# EAGLE design 200 watts standard cool dip (EAGLE 7.6.0)
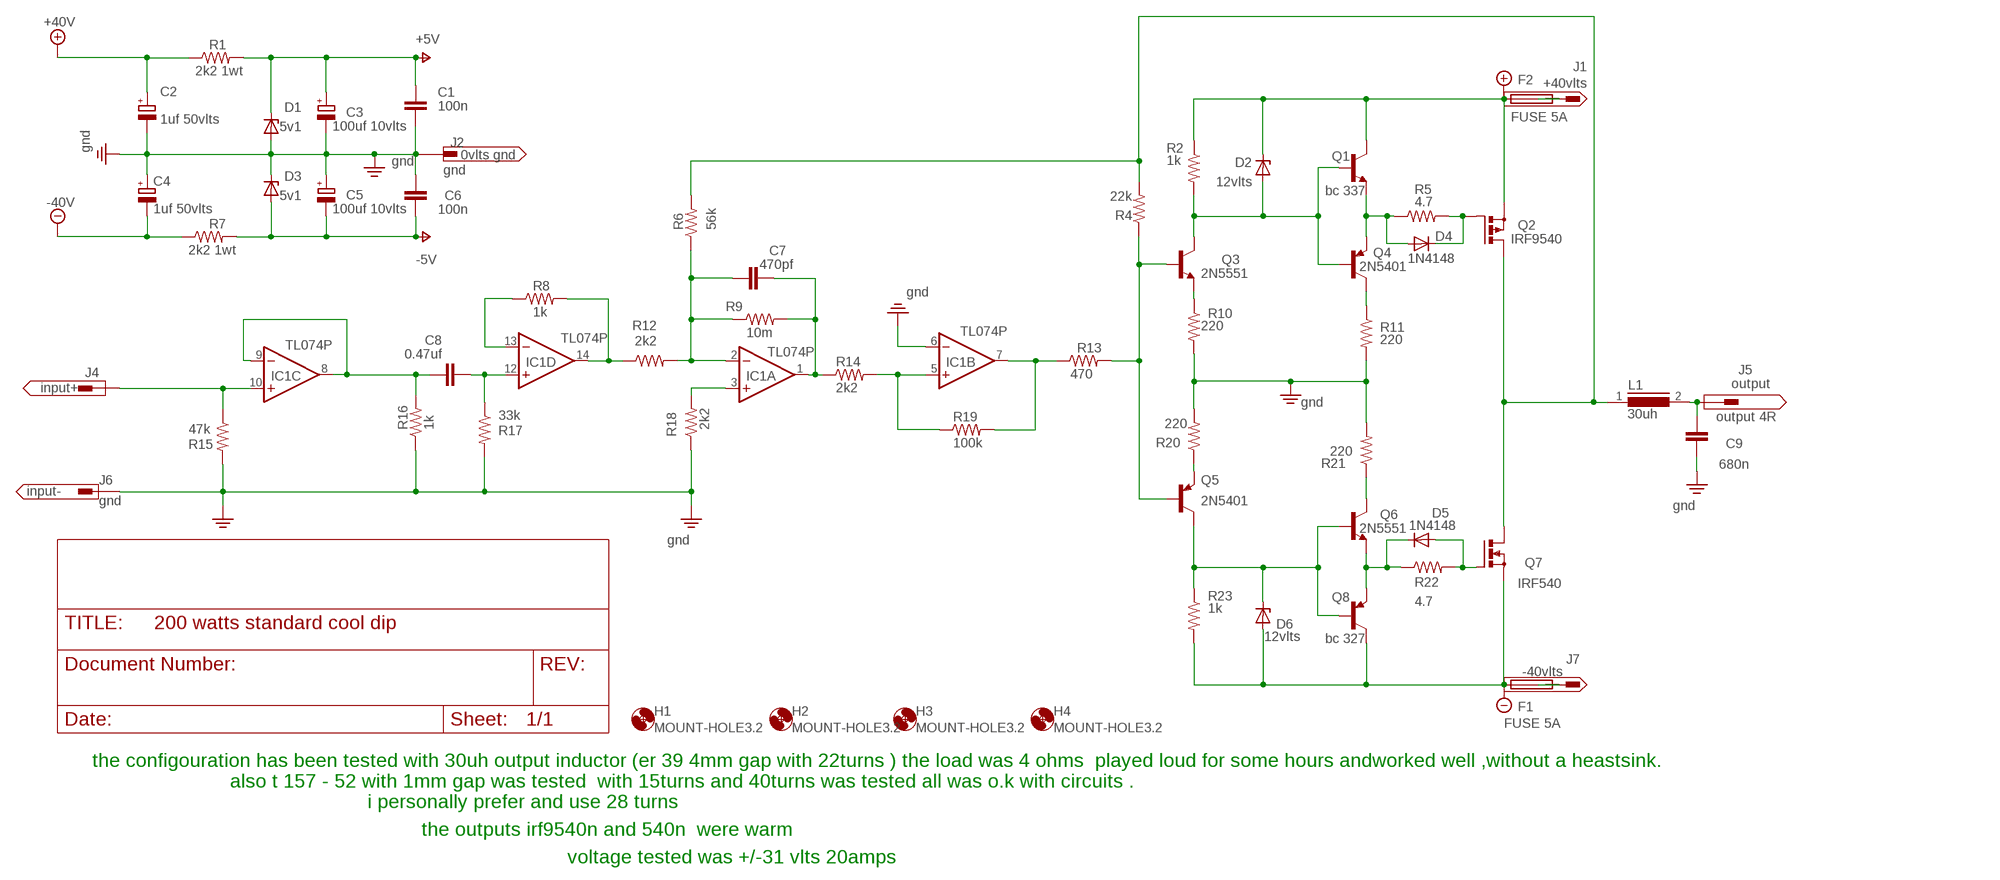
[diagram p0: schematic, sheet 1]

## Parts
C1  100n  C7.5/5  [C7.5B5]
C2  1uf 50vlts  CPOL-EUE2.5-6  [E2,5-6]
C3  100uf 10vlts  CPOL-EUE3.5-8  [E3,5-8]
C4  1uf 50vlts  CPOL-EUE2.5-6  [E2,5-6]
C5  100uf 10vlts  CPOL-EUE3.5-8  [E3,5-8]
C6  100n  C7.5/5  [C7.5B5]
C7  470pf  C5/3.5  [C5B3.5]
C8  0.47uf  C7.5/6  [C7.5B6]
C9  680n  C15/6  [C15B6]
D1  5v1  ZENER-DIODEDO34-7  [DO34Z7]
D2  12vlts  ZENER-DIODEDO34-7  [DO34Z7]
D3  5v1  ZENER-DIODEDO34-7  [DO34Z7]
D4  1N4148  1N4148DO35-7  [DO35-7]
D5  1N4148  1N4148DO35-7  [DO35-7]
D6  12vlts  ZENER-DIODEDO34-7  [DO34Z7]
F1  FUSE 5A  FUSESHK20L  [SHK20L]
F2  FUSE 5A  FUSESHK20L  [SHK20L]
H1  MOUNT-HOLE3.2  [3,2]
H2  MOUNT-HOLE3.2  [3,2]
H3  MOUNT-HOLE3.2  [3,2]
H4  MOUNT-HOLE3.2  [3,2]
IC1  TL074P  [DIL14]
J1  +40v  PIN2F061.040  [F061.040]
J2  gnd  PIN2F061.040  [F061.040]
J4  input  PIN2F061.040  [F061.040]
J5  output  PIN2F061.040  [F061.040]
J6  gnd  PIN2F061.040  [F061.040]
J7  -40v  PIN2F061.040  [F061.040]
L1  30uh  B82131  [SUKW1-17]
Q1  bc 337  BF393-NPN-TO92-CBE  [TO92-CBE]
Q2  IRF9540  PMOSFET_PTO220BV  [TO220BV]
Q3  2N5551  BC338-16-NPN-TO92-EBC  [TO92-EBC]
Q4  2N5401  BC327-25-PNP-TO92-EBC  [TO92-EBC]
Q5  2N5401  BC327-25-PNP-TO92-EBC  [TO92-EBC]
Q6  2N5551  BC338-16-NPN-TO92-EBC  [TO92-EBC]
Q7  IRF540  PMOSFET_NTO220BV  [TO220BV]
Q8  bc 327  BF493S-PNP-TO92-CBE  [TO92-CBE]
R1  2k2 1wt  R-US_0309/12  [0309/12]
R2  1k  R-US_0207/7  [0207/7]
R4  22k  R-US_0207/7  [0207/7]
R5  4.7  R-US_0207/7  [0207/7]
R6  56k  R-US_0207/7  [0207/7]
R7  2k2 1wt  R-US_0309/12  [0309/12]
R8  1k  R-US_0207/2V  [0207/2V]
R9  10m  R-US_0207/2V  [0207/2V]
R10  220  R-US_0207/7  [0207/7]
R11  220  R-US_0207/7  [0207/7]
R12  2k2  R-US_0207/7  [0207/7]
R13  470  R-US_0207/7  [0207/7]
R14  2k2  R-US_0207/10  [0207/10]
R15  47k  R-US_0207/2V  [0207/2V]
R16  1k  R-US_0207/7  [0207/7]
R17  33k  R-US_0207/2V  [0207/2V]
R18  2k2  R-US_0207/7  [0207/7]
R19  100k  R-US_0207/5V  [0207/5V]
R20  220  R-US_0207/7  [0207/7]
R21  220  R-US_0207/7  [0207/7]
R22  4.7  R-US_0207/7  [0207/7]
R23  1k  R-US_0207/7  [0207/7]

## Nets
+5V: C1.1 C3.+ D1.C R1.2
+40V: C2.+ D2.C F2.1A Q1.C Q2.S R1.1 R2.1
-5V: C5.- C6.2 D3.A R7.2
-40V: C4.- D6.A F1.1A Q7.S Q8.C R7.1 R23.2 ; supply symbol labelled -40v
GND: C1.2 C2.- C3.- C4.+ C5.+ C6.1 C9.1 D1.A D3.C IC1.6(B:-IN) J2.A1 J2.A2 J6.A1 J6.A2 R10.2 R11.2 R15.2 R16.1 R17.2 R18.1 R20.2 R21.2 ; supply symbol labelled gnd
N$1: D5.A Q7.G R22.2
N$2: D4.A Q1.E Q4.E R5.1
N$3: D4.C Q2.G R5.2
N$4: C9.2 J5.A1 J5.A2 L1.2
N$5: L1.1 Q2.D Q7.D R4.2 R6.2
N$6: D6.C Q5.C Q6.B Q8.B R23.1
N$7: Q6.C R21.1
N$8: D5.C Q6.E Q8.E R22.1
N$9: Q4.C R11.1
N$10: Q5.E R20.1
N$11: F1.2A J7.A1 J7.A2
N$12: Q3.E R10.1
N$13: D2.A Q1.B Q3.C Q4.B R2.2
N$15: F2.2A J1.A1 J1.A2
N$16: Q3.B Q5.B R4.1 R13.2
N$20: IC1.7(B:OUT) R13.1 R19.2
N$41: IC1.5(B:+IN) R14.2 R19.1
N$49: C7.1 IC1.2(A:-IN) R6.1 R9.1 R12.2
N$54: IC1.3(A:+IN) R18.2
N$55: IC1.14(D:OUT) R8.2 R12.1
N$56: IC1.13(D:-IN) R8.1
N$57: C8.1 IC1.8(C:OUT) IC1.9(C:-IN) R16.2
N$60: C7.2 IC1.1(A:OUT) R9.2 R14.1
N$61: C8.2 IC1.12(D:+IN) R17.1
N$62: IC1.10(C:+IN) J4.A1 J4.A2 R15.1

## Notes on the sheet
- the configouration has been tested with 30uh output inductor (er 39 4mm gap with 22turns ) the load was 4 ohms  played loud for some hours andworked well ,without a heastsink.
- also t 157 - 52 with 1mm gap was tested  with 15turns and 40turns was tested all was o.k with circuits .
                           i personally prefer and use 28 turns
- the outputs irf9540n and 540n  were warm
- voltage tested was +/-31 vlts 20amps

## Power pins joined to a net without a drawn wire
+5V: IC1.4(P:V+)
-5V: IC1.11(P:V-)

## Library data of the parts
C1 C6-C9 = capacitor-wima:C: CAPACITOR naming: grid - package width
C2-C5 = rcl:CPOL-EU: POLARIZED CAPACITOR, European symbol
D1-D3 D6 = diode:ZENER-DIODE: Z-Diode
D4 D5 = diode:1N4148: DIODE high speed (Philips)
F1 F2 = fuse:FUSE: Fuse
H1-H4 = holes:MOUNT-HOLE: MOUNTING HOLE with drill center marker
IC1 = linear:TL074: OP AMP
J1 J2 J4-J7 = con-faston:PIN2: Flachstecker Typ Tyco/Electronics/AMP TAB, FASTON Printed Circuit Board Tabs Source: http://www.buerklin.com, http://catalog.tycoelectronics.com; OC_FARNELL: unknown; OC_NEWARK: unknown
L1 = inductors:B82131: INDUCTOR
Q1 Q3 Q6 = transistor:*-NPN-: NPN Transistror BF959 corrected 2008.03.06
Q2 = transistor-power (2):PMOSFET_P: Power MOSFET P-Channel
Q4 Q5 Q8 = transistor:*-PNP-: PNP Transistror
Q7 = transistor-power (2):PMOSFET_N: Power MOSFET N-Channel
R1 R2 R4-R23 = rcl:R-US_: RESISTOR, American symbol

## Board
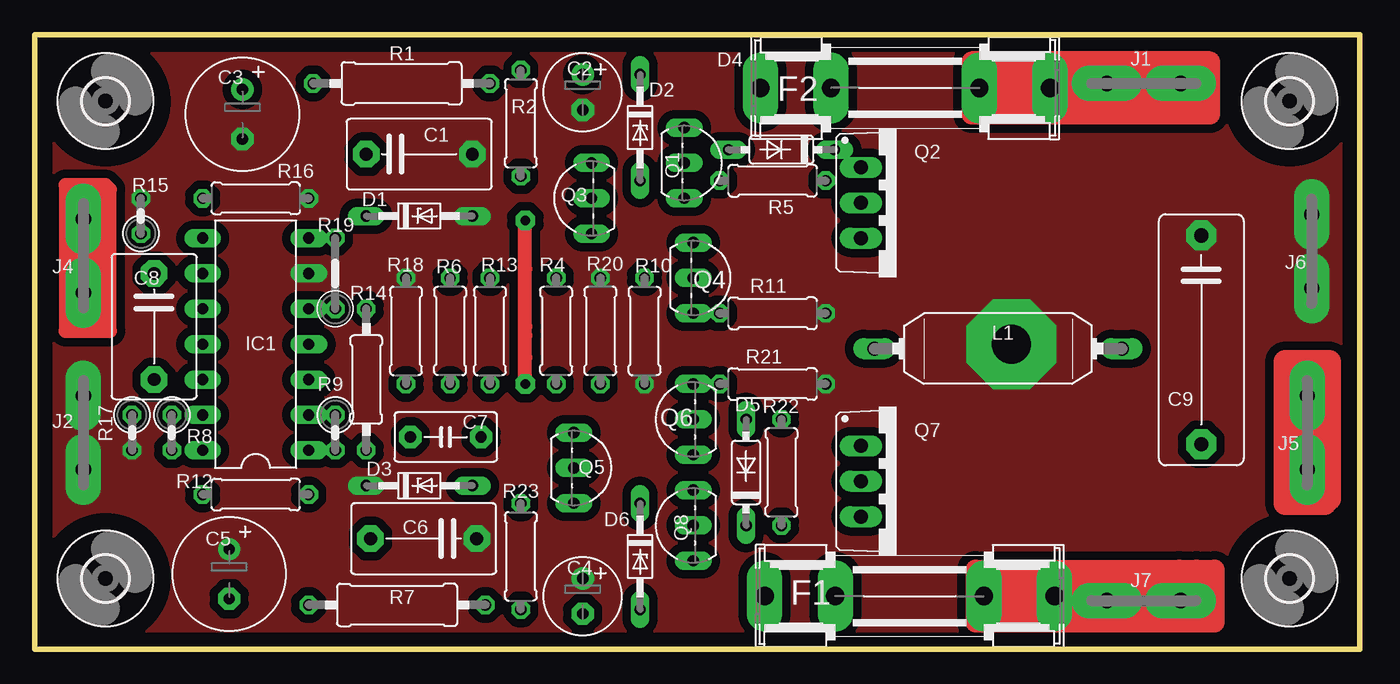
[diagram p1: board, top side]
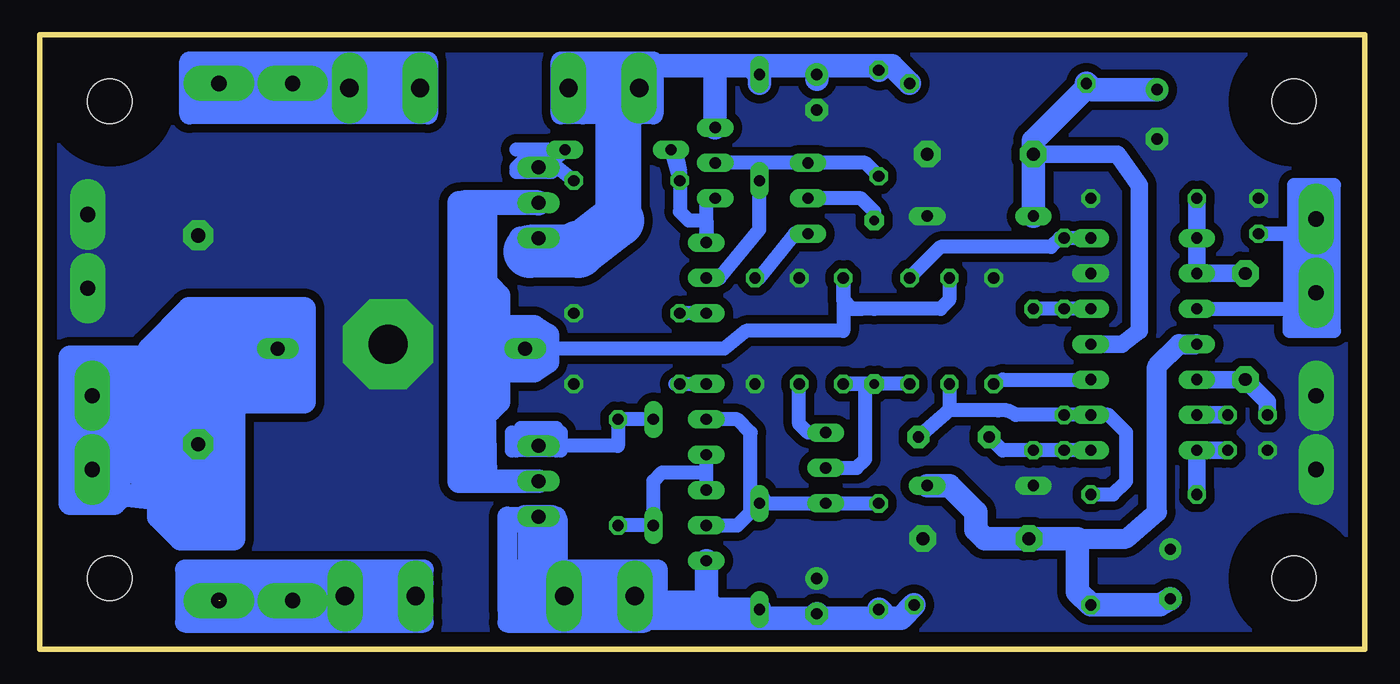
[diagram p2: board, bottom side, seen from below]

Size 95.23 x 44.12 mm. Coordinates in mm from the lower left corner, seen from the top.
Outline: 0,0 95.23,0 95.23,44.12 0,44.12 0,0
Copper layers (1*16): Top 0.035mm / dielectric 1.5mm / Bottom 0.035mm
Design rules "default": minimum track width 10mil, minimum drill 24mil, track to track 8mil, track to pad 8mil, pad to pad 8mil, via to via 8mil, smd to smd 8mil, copper to edge 40mil, drill to drill 8mil, minimum pad ring 10mil, minimum via ring 8mil, stop-mask expansion 4mil, vias tented up to drill 0mil, thermal gap 10mil

### Footprints (pad centres in the part's own frame; a part is rotated, then mirrored left to right if it is on the bottom)
C7.5B5 = drill 0.914 pad 1.905 octagon: 1 -3.81,0; 2 3.81,0
E2,5-6 = drill 0.813 pad 1.6: + -1.27,0 | drill 0.813 pad 1.6 octagon: - 1.27,0
E3,5-8 = drill 0.813 pad 1.6: + -1.778,0 | drill 0.813 pad 1.6 octagon: - 1.778,0
C5B3.5 = drill 0.813 pad 1.6 octagon: 1 -2.54,0; 2 2.54,0
C7.5B6 = drill 0.914 pad 1.905 octagon: 1 -3.81,0; 2 3.81,0
C15B6 = drill 1.016 pad 2.159 octagon: 1 -7.493,0; 2 7.493,0
DO34Z7 = drill 0.813 long: A 3.81,0; C -3.81,0
DO35-7 = drill 0.813 long: A 3.81,0; C -3.81,0
SHK20L = drill 1.321 pad 2.54 long: 1A -10.414,0; 1B -5.334,0; 2A 10.414,0; 2B 5.334,0
3,2 = hole 3.2: 0,0
DIL14 = drill 0.813 long: 1 -7.62,-3.81; 2 -5.08,-3.81; 3 -2.54,-3.81; 4 0,-3.81; 5 2.54,-3.81; 6 5.08,-3.81; 7 7.62,-3.81; 8 7.62,3.81; 9 5.08,3.81; 10 2.54,3.81; 11 0,3.81; 12 -2.54,3.81; 13 -5.08,3.81; 14 -7.62,3.81
F061.040 = drill 1.1 pad 2.54 long: A1 -2.65,0; A2 2.65,0
SUKW1-17 = drill 1.016 long: 1 -8.89,0; 2 8.89,0
TO92-CBE = drill 0.813 long: B 0,0; C -2.54,0; E 2.54,0
TO220BV = drill 1.016 long: D 0,-2.54; G -2.54,-2.54; S 2.54,-2.54
TO92-EBC = drill 0.813 long: B 0,-1.27; C 2.54,-1.27; E -2.54,-1.27
0309/12 = drill 0.813 octagon: 1 -6.35,0; 2 6.35,0
0207/7 = drill 0.813 octagon: 1 -3.81,0; 2 3.81,0
0207/2V = drill 0.813 octagon: 1 -1.27,0; 2 1.27,0
0207/10 = drill 0.813 octagon: 1 -5.08,0; 2 5.08,0
0207/5V = drill 0.813 octagon: 1 -2.54,0; 2 2.54,0

### Placement (x,y rotation side)
C1  27.62,35.56 0 top
C2  39.37,40.01 270 top
C3  14.92,38.42 270 top
C4  39.37,3.81 270 top
C5  13.97,5.4 270 top
C6  27.94,7.94 180 top
C7  29.53,15.24 180 top
C8  8.57,23.18 270 top
C9  83.82,22.23 270 top
D1  27.62,31.11 0 top
D2  43.5,37.47 270 top
D3  27.62,11.75 0 top
D4  53.66,35.88 180 top
D5  51.12,12.7 90 top
D6  43.5,6.67 270 top
F1  62.87,3.81 0 top
F2  62.55,40.32 0 top
H1  5.08,5.08 0 top
H2  5.08,39.37 0 top
H3  90.17,5.08 0 top
H4  90.17,39.37 0 top
IC1  15.88,21.91 90 top
J1  79.69,40.64 0 top
J2  3.49,15.56 270 top
J4  3.49,28.26 270 top
J5  91.44,15.56 270 top
J6  91.76,28.57 270 top
J7  79.69,3.49 0 top
L1  69.22,21.59 0 top
Q1  46.67,34.92 270 top
Q2  61.91,32.07 270 top
Q3  38.73,32.38 90 top
Q4  48.58,26.67 270 top
Q5  40.01,13.02 270 top
Q6  46.04,16.51 90 top
Q7  61.91,12.06 270 top
Q8  47.31,8.89 90 top
R1  26.35,40.64 180 top
R2  34.92,37.78 270 top
R4  37.47,22.86 90 top
R5  53.02,33.66 0 top
R6  29.84,22.86 90 top
R7  26.04,3.17 180 top
R8  9.84,15.56 270 top
R9  21.59,15.56 270 top
R10  43.81,22.86 270 top
R11  53.02,24.13 0 top
R12  15.88,11.11 0 top
R13  32.7,22.86 270 top
R14  23.81,19.37 90 top
R15  7.62,31.11 90 top
R16  15.88,32.38 180 top
R17  6.99,15.56 270 top
R18  26.67,22.86 270 top
R19  21.59,26.99 90 top
R20  40.64,22.86 90 top
R21  53.02,19.05 0 top
R22  53.66,12.7 90 top
R23  34.92,6.67 270 top

### Tracks (layer width: path | path; a pad name or v marks a point on that pad's centre or on a via)
+5V
  Bottom 1.27: IC1.4 17.46,21.91 16.19,22.86 16.19,33.34 17.78,35.56 C1.1
  Bottom 1.676: C3.+ 19.56,40.2 R1.2 20,40.32 23.81,36.51 C1.1 D1.C
+40V
  Bottom 1.016: Q2.S 60.64,29.53 60.64,29.21 60.96,28.89 60.96,28.57 60.96,28.26
  Bottom 1.422: F2.1A 51.75,40.32 51.75,38.73 52.07,38.73 52.07,38.42 56.2,38.42 | 56.2,38.42 57.78,38.42 57.78,41.91 57.78,42.23 51.12,42.23 51.12,38.42 56.2,38.42 | 56.2,38.42 56.2,39.69 55.56,39.69 55.56,39.37 53.34,39.37 53.34,40.96 54.17,40.96 54.17,40.58
  Bottom 1.676: 56.2,41.91 56.52,41.91 56.83,39.69 | 56.2,40.64 56.2,41.91 | 56.2,41.91 46.67,41.91 | 46.67,41.91 44.13,41.91 | 44.13,41.91 D2.C | D2.C 43.5,41.59 | 43.5,41.59 43.18,41.91 43.81,41.91 | 43.81,41.91 44.13,41.91 | 44.13,41.91 43.81,41.91 | 43.81,41.91 39.05,41.91 | 39.05,41.91 34.92,41.91 | 34.92,41.91 33.97,41.91 R1.1 | R2.1 34.92,41.91 | C2.+ 39.37,40.96 39.37,41.59 39.05,41.91 | D2.C 43.5,40.64 43.5,41.59 | 43.5,41.59 43.81,41.91 | 43.81,41.91 46.67,41.91 | 46.67,41.91 Q1.C | 60.96,28.57 60.96,28.26 60.96,28.57 | 60.96,28.57 60.96,28.89 | 60.96,28.89 60.64,29.21 | 60.64,29.21 60.64,29.53 | 60.64,29.53 Q2.S | Q2.S 60.64,29.53 | 60.64,29.53 60.64,29.21 | 60.64,29.21 60.96,28.89 | 60.96,28.89 60.96,28.57 | 60.01,28.57 60.01,28.89 Q2.S
  Bottom 1.778: 56.83,39.69 56.52,41.91 57.15,40.32 54.93,40.96
  Bottom 2.54: 54.93,40.96 54.17,40.58 53.66,40.32
  Bottom 3.302: 53.66,40.32 53.66,30.8
  Bottom 3.81: 53.66,30.8 56.52,28.57 | 56.52,28.57 56.52,28.89 56.52,28.57 | 56.52,28.57 60.01,28.57
-5V
  Bottom 1.422: C6.2 22.86,7.94 20.64,7.94 17.14,7.94 14.92,9.84 14.92,20.32 13.34,21.91 IC1.11
  Bottom 1.676: D3.A 29.84,11.75 27.94,9.84 27.94,8.57 27.3,7.94 C6.2 22.86,7.94 20.64,7.94 20.64,4.13 R7.2 14.73,3.17 C5.-
-40V
  Bottom 1.422: 47.31,3.49 50.8,3.49 50.8,5.71 61.28,5.71 61.59,5.4 | 61.59,5.4 61.59,1.91 | 61.59,1.91 60.96,2.54 61.59,1.91 | 61.59,1.91 51.75,1.91 51.75,3.17 | 51.75,3.17 51.75,4.45 58.1,4.45 58.1,4.13 | 58.1,4.13 58.1,3.17 51.75,3.17 | 51.75,3.17 61.59,3.49 61.59,2.86 61.59,5.4 | 61.59,5.4 61.59,9.53 58.1,9.53 58.1,4.13 | 58.1,4.13 53.34,4.13 52.45,4.13 F1.1A
  Bottom 1.676: 60.01,2.22 59.05,2.22 | 59.05,2.22 59.05,3.17 | 59.05,3.17 58.42,2.22 44.13,2.22 D6.A | D6.A 43.5,2.54 43.81,2.22 39.69,2.22 C4.- 39.37,2.22 33.34,2.22 | 33.34,2.22 R7.1 | 33.34,2.22 34.29,2.22 R23.2 | D6.A 46.67,2.86 47.31,3.49 Q8.C | 59.05,2.22 58.1,3.17 58.1,4.13 58.1,4.45 58.1,9.21 58.42,9.53 59.05,9.53 | 59.05,9.53 Q7.S | Q7.S 60.01,9.53 | 60.01,9.53 60.33,9.53 60.96,9.21 | 59.05,3.17 59.05,2.54 59.69,3.17 | 59.69,3.17 60.01,2.22 | 60.01,2.22 60.01,5.4 | 60.01,2.86 59.69,3.17 | 59.69,3.17 59.05,3.81 59.05,9.53 | 59.05,9.53 Q7.S | Q7.S 60.01,9.53 | 60.01,9.53 60.01,2.22 | 60.01,2.22 60.01,3.81 60.64,4.45 | 60.01,2.22 59.69,3.17
GND  (via drill 2.8 pad 6.45)
  other vias: 70.17,21.91
  pour Bottom (isolate 0.61, no thermals): 1.27,1.27 93.98,1.27 93.98,43.18 1.27,43.18
  pour Top (isolate 0.61, no thermals): 1.27,1.27 93.98,1.27 93.98,43.18 1.27,43.18
N$1
  Bottom 1.016: D5.A R22.2 53.66,14.61 57.78,14.61 | 57.78,14.61 Q7.G 59.05,14.61 58.1,14.29 | 58.1,14.29 61.28,14.29 61.28,15.56 | 60.96,14.29 60.96,15.24 60.64,14.92 58.42,14.92 57.78,15.56 | 57.78,15.56 57.78,14.61 | 57.78,14.61 57.78,14.29 58.1,14.29 | 58.1,14.29 57.78,14.61 | 57.78,14.61 57.78,15.56 | 57.78,15.56 58.1,15.88 60.64,15.88
N$2
  Bottom 1.016: R5.1 D4.A 49.53,35.88 49.21,34.29 49.21,33.34 49.21,31.43 48.58,30.8 47.31,30.8 | 47.31,30.8 Q4.E 47.31,30.48 47.31,30.8 | 47.31,30.8 47.31,31.43 47.31,32.38 Q1.E
N$3
  Bottom 1.016: D4.C 58.42,34.92 | 58.42,34.92 R5.2 58.42,34.92 | 58.42,34.92 Q2.G 59.69,34.61 59.69,34.92 59.05,35.56 60.01,35.56 60.96,34.61 60.96,34.29 58.42,34.29 58.42,35.56 58.74,35.88 60.96,35.88
N$4  (via drill 0.7 pad 1.42)
  Top 1.676: J5.A2 91.44,12.7 93.03,11.11 93.03,20.64 89.85,20.64 89.85,10.48 90.81,10.48 | 90.81,10.48 92.71,10.48 | 92.71,10.48 93.03,10.79 93.03,18.1 91.44,19.68 v91.44,13.02 | v91.44,13.02 91.44,11.75 92.71,10.48 | 92.71,10.48 90.81,10.48 | 90.81,10.48 90.81,19.37 90.49,19.68 90.49,13.97 v91.44,13.02
  Bottom 1.016: 81.28,17.78 81.92,18.1 83.19,16.83 83.19,11.43 84.14,10.48 84.14,20.64 83.82,20.95 83.5,21.27 78.74,21.27 L1.2
  Bottom 1.676: v91.44,13.02 91.44,12.7 91.44,12.38 93.03,10.79 93.03,12.06 | 93.03,12.06 93.03,20.64 91.76,20.64 | 91.76,20.64 91.12,20.64 | 91.12,20.64 89.85,20.64 89.85,10.48 93.03,10.48 93.03,12.06 | 93.03,12.06 92.08,11.11 92.08,20.32 91.76,20.64 | 91.76,20.64 91.44,20.64 91.12,20.32 91.12,11.11 91.44,10.79 90.49,10.79 90.49,20 91.12,20.64 | 91.12,20.64 91.76,20.64 | 91.76,20.64 91.76,13.02 | 91.76,13.02 91.76,12.38 | 91.76,12.38 91.76,10.79 91.76,12.38 | 91.76,12.38 89.53,11.11 | 89.53,11.11 86.68,10.79 86.68,10.16 86.68,9.53 85.09,7.94 81.28,7.94 81.28,17.78 76.52,17.78 76.2,17.78 76.2,24.45 76.83,21.27 76.52,24.45 84.45,24.45 87.31,21.59 87.31,20.95 87.31,20.64 87.63,20.32 87.63,20.64 87.95,20.95 93.03,20.95 93.03,14.29 91.76,13.02 | 91.76,13.02 89.53,10.79 89.53,11.11 | 89.53,11.11 89.53,18.73 89.22,19.05 89.22,19.37 86.68,19.37 86.04,20 86.04,20.95 83.5,23.5
  Bottom 2.54: 83.5,23.5 77.79,23.5 76.83,22.23 76.83,21.27 77.47,20.95
  Bottom 3.81: 77.47,20.95 83.82,20.95 85.09,19.68 87.63,17.14 87.63,13.97 87.95,13.65 87.31,13.65 84.14,10.48 83.82,10.16 82.55,10.16 82.55,19.05 78.42,19.05 77.79,19.68 83.5,19.68 86.04,17.14 86.04,15.88 85.09,14.92 85.09,12.19 C9.2 83.82,12.38 85.72,14.29 90.49,14.29 91.76,13.02 | J5.A1 91.44,18.41 81.6,18.41 L1.2
N$5
  Bottom 1.016: R6.2 29.84,25.08 30.48,24.45 35.24,24.45 36.2,24.45 | 36.2,24.45 36.83,24.45 | 36.83,24.45 37.47,25.08 | 37.47,25.08 R4.2 37.47,26.35 37.47,25.08 | 37.47,25.08 36.83,24.45 | 36.83,24.45 36.2,24.45 | 36.2,24.45 36.83,24.45 | 36.83,24.45 37.47,25.08 | 37.47,25.08 37.47,22.86 44.45,22.86 46.04,21.59 L1.1 | L1.1 60.64,21.59 L1.1
  Bottom 1.676: Q7.D 63.5,12.06 | 63.5,12.06 64.14,12.06 | 64.14,12.06 65.09,12.06 | 65.09,12.06 64.14,12.06 | 64.14,12.06 63.5,12.06 | 63.5,12.06 Q7.D | Q7.D 63.5,12.06 | 63.5,12.06 63.18,12.38 63.5,26.67 | 63.5,26.67 63.18,26.04 | 63.18,26.04 63.5,32.07 Q2.D | 63.18,26.04 63.18,31.75 64.14,32.07 64.45,32.07 | 64.45,32.07 65.09,32.07 65.09,12.7 65.09,12.06 | 65.09,12.06 64.14,12.06 | 64.14,12.06 64.45,21.59 | 64.45,21.59 64.45,32.07 | 64.45,32.07 64.45,21.59 | 64.45,21.59 64.45,22.86 64.14,23.18 59.69,23.18 58.74,22.54 58.74,20.64 59.69,20 62.23,20 | 62.23,20 62.87,19.68 63.18,20 63.18,21.59 62.55,20.95 60.33,20.95 60.01,20.64 60.01,21.91 59.69,22.23 62.55,22.23 62.55,24.13 | 62.55,24.13 62.55,25.72 63.5,26.67 | 63.5,26.67 63.5,17.14 63.18,16.83 62.87,17.14 | 62.87,17.14 62.23,17.78 | 62.23,17.78 62.23,20 | 62.23,20 61.59,20.64 61.59,21.91 62.23,22.54 62.23,25.4 63.18,25.4 63.18,20.64 62.23,20 | 62.23,20 62.23,17.78 | 62.23,17.78 62.87,17.14 | 62.87,17.14 62.87,23.81 62.55,24.13 | 62.55,24.13 62.55,22.86 61.28,21.59 L1.1
  Bottom 1.778: Q2.D 63.5,32.07 64.14,32.07 64.45,32.07 64.77,32.07
N$6
  Bottom 1.016: D6.C 44.13,9.84 | 44.13,9.84 43.81,10.79 | 43.81,10.79 43.5,11.11 | 43.5,11.11 43.18,10.79 44.13,9.84 | 44.13,9.84 43.81,10.79 | 43.81,10.79 44.13,9.84 | 44.13,9.84 43.5,11.11 | 43.5,11.11 44.13,9.84 | 44.13,9.84 44.13,15.56 45.09,16.51 Q6.B | Q8.B 45.09,8.89 44.13,9.84 | 44.13,9.84 D6.C | D6.C Q5.C R23.1
N$7
  Bottom 1.016: R21.1 49.53,19.05 Q6.C
N$8
  Bottom 1.016: Q8.E 47.31,12.7 | 47.31,12.7 Q6.E | 47.31,12.7 50.48,12.7 51.12,12.06 D5.C R22.1
N$9
  Bottom 1.016: Q4.C R11.1
N$10
  Bottom 1.016: Q5.E 40.01,15.56 40.64,16.19 40.64,18.73 R20.1
N$11  (via drill 0.6)  (1 unrouted)
  Top 1.422: v82.23,3.49 82.23,5.71 84.77,5.71 84.77,1.91 67.63,1.91 67.63,5.71 83.5,5.71 83.5,5.08 83.5,4.45 | 83.5,4.45 83.5,2.86 68.26,2.86 68.26,4.45 83.5,4.45 | 83.5,4.45 83.82,4.45 83.82,3.81 F1.2A | F1.2A 68.9,3.81 68.9,4.13 73.28,4.13 F1.2A
  Bottom 1.422: J7.A1 68.58,3.49 | 68.58,3.49 67.63,3.49 67.63,4.76 | 67.63,4.76 67.63,5.71 84.77,5.71 84.77,1.91 67.63,1.91 67.63,4.76 | 67.63,4.76 83.82,4.76 83.82,2.54 68.58,2.54 68.58,3.49 | 68.58,3.49 v82.23,3.49 | v82.23,3.49 83.5,3.49 82.23,2.86 v82.23,3.49
N$12
  Bottom 1.016: R10.1 43.5,26.67 40.96,29.84 Q3.E
N$13
  Bottom 1.016: R2.2 35.88,34.92 Q3.C 43.5,34.92 | 43.5,34.92 43.5,34.29 D2.A | D2.A 43.5,34.92 | 43.5,34.92 46.35,34.92 Q1.B | Q4.B 46.67,26.67 46.35,26.67 43.5,30.16 43.5,32.07 D2.A
N$15
  Top 1.422: J1.A1 76.83,40.64 76.83,42.23 67.31,42.23 67.31,38.42 84.45,38.42 84.45,42.23 68.26,42.23 68.26,40.96 83.82,40.96 83.82,40.64 83.82,39.37 67.94,39.37 67.94,39.69 82.34,39.69 J1.A2
  Bottom 1.422: F2.2A 73.03,40.32 73.03,42.23 67.31,42.23 67.31,38.42 84.45,38.42 84.45,42.23 68.26,42.23 68.26,40.96 83.82,40.96 83.82,40.64 83.82,39.69 67.94,39.69 67.94,40.01 67.94,39.37 83.82,39.37 82.34,39.37 J1.A2
N$16  (via drill 0.7 pad 1.42)
  Top 1.016: v35.24,19.05 35.24,20.95 35.24,22.54 35.24,23.18 35.24,27.3 v35.24,30.8
  Bottom 1.016: R13.2 v35.24,19.05 | v35.24,19.05 35.88,19.05 | 35.88,19.05 R4.1 | Q5.B 36.51,13.02 35.88,13.65 35.88,19.05 | 35.88,19.05 R4.1 | R4.1 35.88,19.05 | 35.88,19.05 v35.24,19.05 | v35.24,30.8 35.24,31.43 36.2,32.38 Q3.B
N$20
  Bottom 1.016: IC1.7 R19.2 21.91,29.53 22.54,28.89 30.48,28.89 R13.1
N$41
  Bottom 1.016: IC1.5 R19.1 R14.2
N$49
  Bottom 1.016: R12.2 18.1,11.11 17.14,12.06 17.14,15.56 18.41,16.83 IC1.2 R9.1 25.08,16.83 25.72,17.14 26.35,17.14 29.84,17.14 | 29.84,17.14 C7.1 | R6.1 29.84,17.14
N$54
  Bottom 1.016: R18.2 26.04,19.37 IC1.3
N$55
  Bottom 1.27: R8.2 IC1.14 R12.1
N$56
  Bottom 1.27: IC1.13 R8.1
N$57
  Bottom 1.27: C8.1 IC1.9 IC1.8 R16.2
N$60
  Bottom 1.016: IC1.1 R9.2 R14.1 26.04,14.29 C7.2
N$61
  Bottom 1.27: R17.1 6.99,17.78 C8.2 IC1.12
N$62  (1 unrouted)
  Top 1.016: J4.A1 3.49,31.75 3.81,32.07 | 3.81,32.07 3.97,32.23 | 3.97,32.23 4.13,32.7 | 4.13,32.7 5.08,33.34 | 5.08,33.34 4.45,33.34 | 4.45,33.34 2.22,33.34 2.22,22.86 3.49,22.86 | 3.49,22.86 5.4,22.86 5.4,33.02 5.08,33.34 | 5.08,33.34 4.45,33.34 | 5.08,33.34 4.13,32.7 | 5.08,33.34 4.13,32.7 | 4.13,32.7 3.97,32.23 | 3.97,32.23 3.81,32.07 | 5.08,33.34 4.13,33.34 3.17,32.7 3.17,25.4 | 3.17,25.4 3.17,23.5 | 3.17,23.5 3.17,23.18 3.49,22.86 | 5.08,33.34 5.08,24.45 4.13,23.18 4.13,32.7 | 5.08,33.34 3.97,32.23 | 5.08,33.34 5.08,25.4 3.17,23.5 | 5.08,33.34 5.08,27.3 3.17,25.4
  Bottom 1.016: IC1.10 5.4,24.45 5.4,23.18 5.4,22.86 | 5.4,22.86 2.22,22.86 2.22,33.34 5.08,33.34 | 5.08,33.34 5.08,29.84 5.4,29.84 | 5.4,29.84 R15.1 5.4,29.84 | 5.4,29.84 5.4,22.86 | 5.4,22.86 5.4,23.7 J4.A2 | 5.08,33.34 4.13,33.34 3.65,32.86 | 3.65,32.86 3.49,32.38 3.49,24.13 3.17,32.7 3.17,24.13 2.86,24.13 2.86,23.81 3.49,23.81 4.45,23.5 4.45,32.07 3.65,32.86